# EAGLE schematic Esquema atmega v9 (EAGLE 9.7.0)
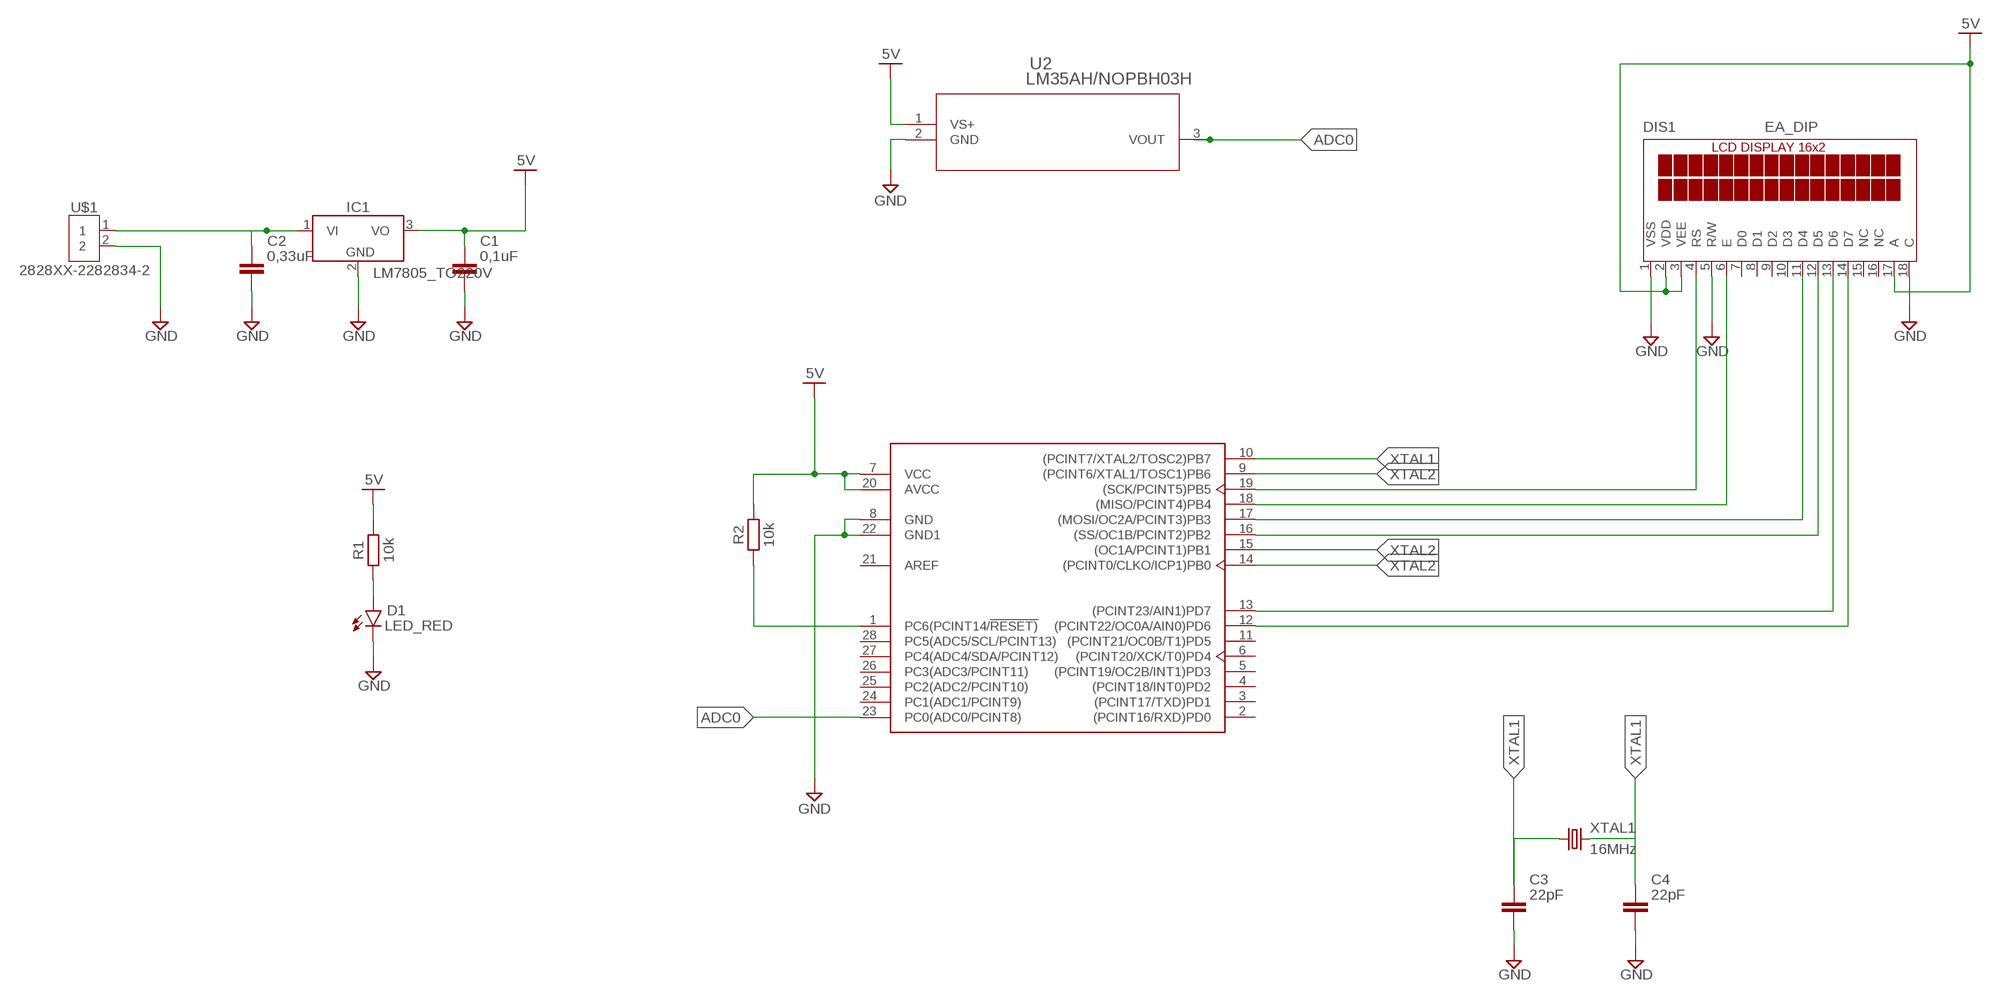
[diagram p0: schematic, sheet 1]

## Parts
C1  0,1uF  C_RADIAL-12.5MM-DIA  [CAPRD550W60D1025H1250B]
C2  0,33uF  C_RADIAL-12.5MM-DIA  [CAPRD550W60D1025H1250B]
C3  22pF  C_RADIAL-12.5MM-DIA  [CAPRD550W60D1025H1250B]
C4  22pF  C_RADIAL-12.5MM-DIA  [CAPRD550W60D1025H1250B]
D1  LED_RED  LED_RADIAL_RED  [LEDRD254W60D565H860B]
DIS1  EA_DIP  [EA_DIP]
IC1  LM7805_TO220V  [TO220V]
R1  10k  R_AXIAL-7.2MM-PITCH  [RESAD724W46L381D178B]
R2  10k  R_AXIAL-7.2MM-PITCH  [RESAD724W46L381D178B]
U1  ATMEGA328P-PU  [DIP-28]
U2  LM35AH/NOPBH03H  [H03H]
U$1  2828XX-2282834-2  [TERMBLK_254-2N]
XTAL1  16MHz  CRYSTAL_HC49-11.5L  [XTALRR488W45L1150T500H350B]

## Nets
+V: C1.1 DIS1.2(VDD) DIS1.3(VEE) DIS1.17(A) IC1.3(VO) R1.2 R2.2 U1.7(VCC) U1.20(AVCC) U2.1(VS+) ; supply symbol labelled 5V
ADC0: U1.23(PC0(ADC0/PCINT8)) U2.3(VOUT)
ADC1: U1.10((PCINT7/XTAL2/TOSC2)PB7)
ADC2: U1.9((PCINT6/XTAL1/TOSC1)PB6)
ADC3: DIS1.4(RS) U1.19((SCK/PCINT5)PB5)
ADC4: DIS1.6(E) U1.18((MISO/PCINT4)PB4)
ADC5: DIS1.11(D4) U1.17((MOSI/OC2A/PCINT3)PB3)
ADC6: DIS1.12(D5) U1.16((SS/OC1B/PCINT2)PB2)
ADC7: DIS1.13(D6) U1.13((PCINT23/AIN1)PD7)
ADC8: U1.14((PCINT0/CLKO/ICP1)PB0)
ADC9: DIS1.14(D7) U1.12((PCINT22/OC0A/AIN0)PD6)
D6: U1.15((OC1A/PCINT1)PB1)
GND: C1.2 C2.2 C3.2 C4.2 D1.2(C) DIS1.1(VSS) DIS1.5(R/W) DIS1.18(C) IC1.2(GND) U1.8(GND) U1.22(GND1) U2.2(GND) U$1.2
N$1: C2.1 IC1.1(VI) U$1.1
N$2: D1.1(A) R1.1
N$3: C3.1 XTAL1.1
N$4: C4.1 XTAL1.2
N$5: R2.1 U1.1(PC6(PCINT14/!RESET))
Unconnected: DIS1.7(D0) DIS1.8(D1) DIS1.9(D2) DIS1.10(D3) DIS1.15(NC) DIS1.16(NC) U1.2((PCINT16/RXD)PD0) U1.3((PCINT17/TXD)PD1) U1.4((PCINT18/INT0)PD2) U1.5((PCINT19/OC2B/INT1)PD3) U1.6((PCINT20/XCK/T0)PD4) U1.11((PCINT21/OC0B/T1)PD5) U1.21(AREF) U1.24(PC1(ADC1/PCINT9)) U1.25(PC2(ADC2/PCINT10)) U1.26(PC3(ADC3/PCINT11)) U1.27(PC4(ADC4/SDA/PCINT12)) U1.28(PC5(ADC5/SCL/PCINT13))

## Library data of the parts
C1-C4 = Tutorial - Fusion 360:C: Capacitor - Generic; CATEGORY: Capacitor
D1 = Opto-Electronic:LED_RADIAL: LED - Generic; CATEGORY: Opto-Electronic; SUB-CATEGORY: LED
DIS1 = display-lcd:EA_DIP: LCD-MODUL 2x16 - 6,68mm, INKL. KONTROLLER HD44780 Source: Data sheet <http://www.lcd-module.de/pdf/doma/dip162-d.pdf>
IC1 = IC_Power-Management:LM7805: 5V Voltage Regulator Reference Datasheet <https://www.ti.com/lit/ds/symlink/lm340.pdf>; CATEGORY: IC_Linear; DESCRIPTION: 5V Voltage Regulator; MANUFACTURER: Generic; MPN: Generic; SERIES: LM7805; SUB-CATEGORY: Voltage Regulator; TYPE: 5V
R1 R2 = Resistor:R: Resistor Fixed - Generic; CATEGORY: Resistor; SUB-CATEGORY: Fixed
U1 = Microcontroller:ATMEGA328P-PU: IC MCU 8BIT 32KB FLASH 28DIP Manufacturer's datasheet <http://ww1.microchip.com/downloads/en/DeviceDoc/ATmega48A-PA-88A-PA-168A-PA-328-P-DS-DS40002061A.pdf>; CREATED_BY: PCBLayout.com; DIGIKEY_PART_NUMBER: ATMEGA328P-PU-ND; MANUFACTURER: Microchip Technology; MPN: ATMEGA328P-PU; PACKAGE: DIP-28
U2 = LM35AH:LM35AH/NOPB; COPYRIGHT: Copyright (C) 2022 Ultra Librarian. All rights reserved.; MANUFACTURER_PART_NUMBER: LM35AH/NOPB; MFR_NAME: Texas Instruments; TYPE: LM35AH
U$1 = Connector:2828XX-2: 2 Position Wire to Board Terminal Block Horizontal with Board Datasheet <https://www.te.com.cn/commerce/DocumentDelivery/DDEController?Action=showdoc&DocId=Catalog+Section%7F1308389_EUROSTYLE_TERMINAL_BLOCKS%7F0607%7Fpdf%7FEnglish%7FENG_CS_1308389_EUROSTYLE_TERMINAL_BLOCKS_0607.pdf%7F2-282837-5>
XTAL1 = Frequency-Source:CRYSTAL: Crystal 2Pin - Generic; CATEGORY: Frequency-Source; SUB-CATEGORY: Crystal-2Pin; VALUE: HC49